# Altium schematic sheet K22Power.SchDoc
size Letter; Organization: Altium Limited; Address1: L3, 12a Rodborough Rd; Address2: Frenchs Forest; Address3: NSW; Address4: Australia 2086
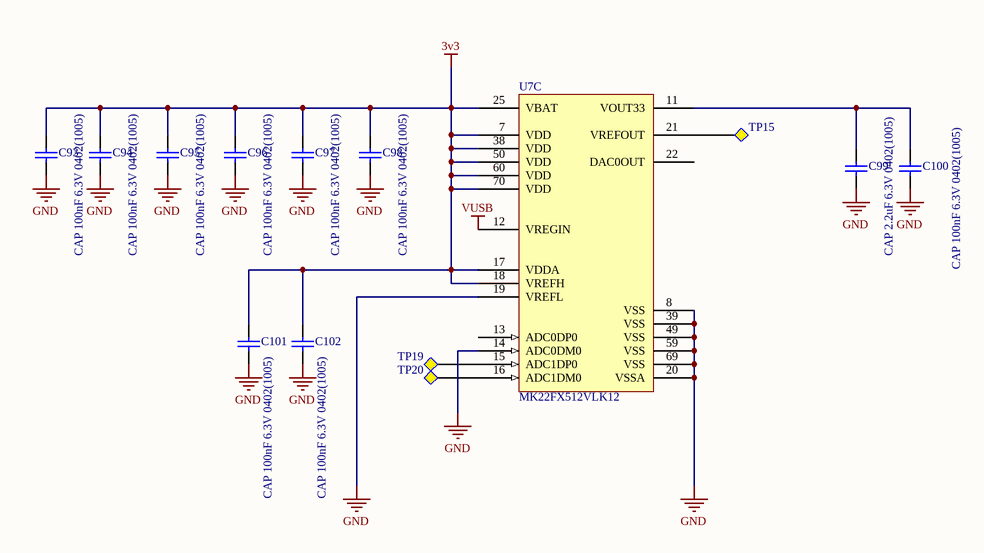
[diagram p0: K22Power.SchDoc]

## Parts
C93  CAP 100nF 6.3V 0402(1005)  [CAPC0402(1005)60_M]
C94  CAP 100nF 6.3V 0402(1005)  [CAPC0402(1005)60_M]
C95  CAP 100nF 6.3V 0402(1005)  [CAPC0402(1005)60_M]
C96  CAP 100nF 6.3V 0402(1005)  [CAPC0402(1005)60_M]
C97  CAP 100nF 6.3V 0402(1005)  [CAPC0402(1005)60_M]
C98  CAP 100nF 6.3V 0402(1005)  [CAPC0402(1005)60_M]
C99  CAP 2.2uF 6.3V 0402(1005)  [CAPC0402(1005)60_L]
C100  CAP 100nF 6.3V 0402(1005)  [CAPC0402(1005)60_M]
C101  CAP 100nF 6.3V 0402(1005)  [CAPC0402(1005)60_M]
C102  CAP 100nF 6.3V 0402(1005)  [CAPC0402(1005)60_M]
TP15  Test Point  [TP]  (value not drawn)  (no BOM)
TP19  Test Point  [TP]  (value not drawn)  (no BOM)
TP20  Test Point  [TP]  (value not drawn)  (no BOM)
U7  MK22FX512VLK12  [TSQFP50P1400X1400X160-80N]  (part C of 3)

## Nets
3v3: C93.2 C94.2 C95.2 C96.2 C97.2 C98.2 C101.2 C102.2 U7.7(VDD) U7.17(VDDA) U7.18(VREFH) U7.25(VBAT) U7.38(VDD) U7.50(VDD) U7.60(VDD) U7.70(VDD)
GND: C93.1 C94.1 C95.1 C96.1 C97.1 C98.1 C99.1 C100.1 C101.1 C102.1 U7.8(VSS) U7.14(ADC0DM0) U7.19(VREFL) U7.20(VSSA) U7.39(VSS) U7.49(VSS) U7.59(VSS) U7.69(VSS)
VUSB: U7.12(VREGIN)
NetC99_2: C99.2 C100.2 U7.11(VOUT33)
NetTP15_1: TP15.1 U7.21(VREFOUT)
NetTP19_1: TP19.1 U7.15(ADC1DP0)
NetTP20_1: TP20.1 U7.16(ADC1DM0)

Not connected (* = marked no-connect by the designer): U7 13(ADC0DP0) 22(DAC0OUT)

## Notes on the sheet
- Title
- Size:
- Date:
- Letter
- Number:
- Time:
- Revision:
- Sheet
- of
- Copyright 2018
- Specialized Solutions LLC
- 206 W Lincoln Hwy STE B
- New Haven, IN 46774
- www.specsolns.com <http://www.specsolns.com>
- File:

## Library data of the parts
C93-C98 C100-C102 = CMP-1034-02062-1: CAP 100nF 6.3V ±20% 0402 (1005 Metric) Thickness 0.6mm SMD; Case-EIA: 0402; Tolerance: Â±20%; Case-Metric: 1005; Value: 100nF; Technology: SMT; Max Thickness: 0.6 mm; Rated Voltage: 6.3 V
C99 = CMP-1034-02126-1: CAP 2.2uF 6.3V ±20% 0402 (1005 Metric) Thickness 0.6mm SMD; Case-Metric: 1005; Case-EIA: 0402; Tolerance: Â±20%; Rated Voltage: 6.3 V; Max Thickness: 0.6 mm; Value: 2.2uF; Technology: SMT
TP15 TP19 TP20 = TP